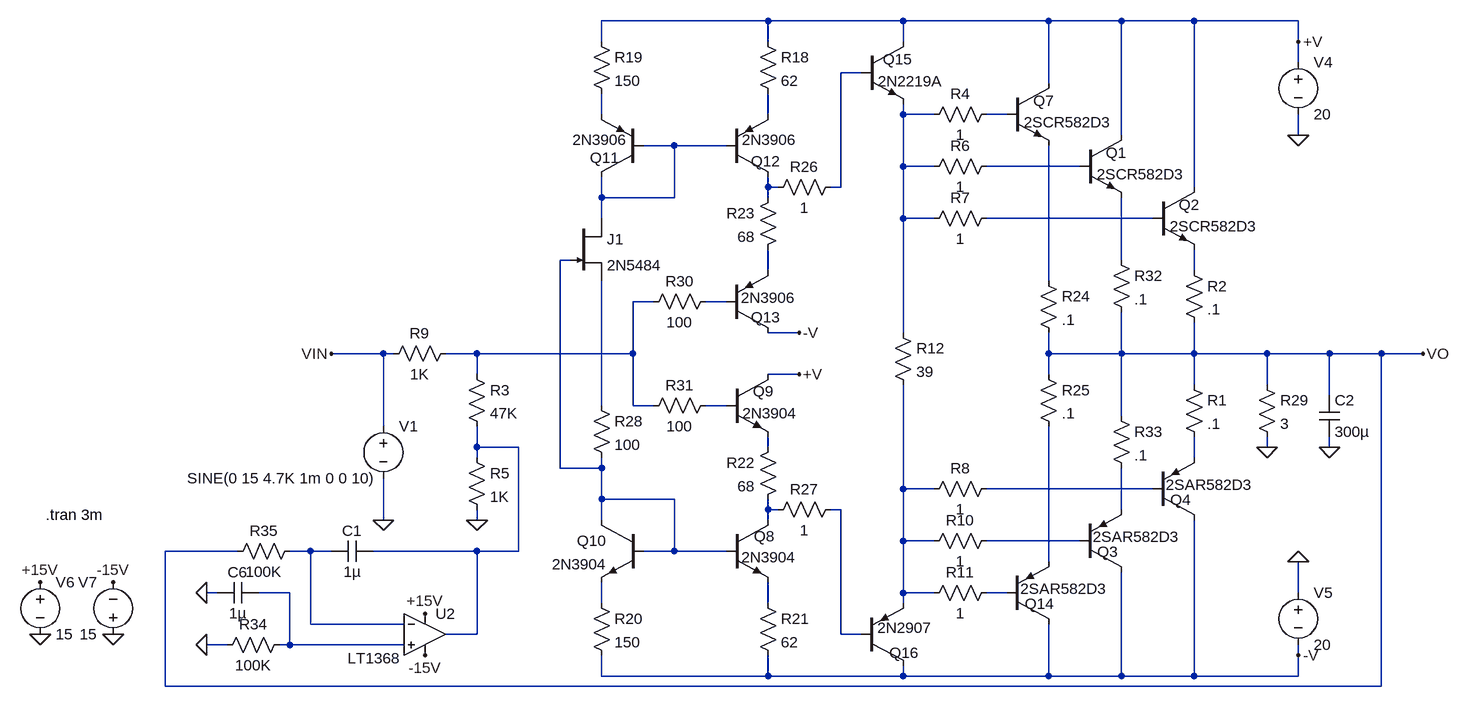
[diagram p0: schematic Current Amp-Adj_Bias-Servo-1.asc]
Current Amp-Adj_Bias-Servo-1.asc, the LTspice schematic file:
Version 4
SHEET 1 900 712
WIRE -160 -384 -416 -384
WIRE 48 -384 -160 -384
WIRE 272 -384 48 -384
WIRE 384 -384 272 -384
WIRE 496 -384 384 -384
WIRE 656 -384 496 -384
WIRE -416 -352 -416 -384
WIRE -160 -352 -160 -384
WIRE 48 -352 48 -384
WIRE 656 -352 656 -384
WIRE 656 -320 656 -352
WIRE -16 -304 -48 -304
WIRE 272 -288 272 -384
WIRE -416 -240 -416 -272
WIRE -160 -240 -160 -272
WIRE 48 -240 48 -256
WIRE 96 -240 48 -240
WIRE 208 -240 176 -240
WIRE 384 -208 384 -384
WIRE 656 -208 656 -240
WIRE -304 -192 -352 -192
WIRE -224 -192 -304 -192
WIRE 48 -160 48 -240
WIRE 96 -160 48 -160
WIRE 320 -160 176 -160
WIRE -160 -128 -160 -144
WIRE -144 -128 -160 -128
WIRE -48 -128 -48 -304
WIRE -48 -128 -64 -128
WIRE 496 -128 496 -384
WIRE -416 -112 -416 -144
WIRE -304 -112 -304 -192
WIRE -304 -112 -416 -112
WIRE -160 -112 -160 -128
WIRE -416 -80 -416 -112
WIRE 48 -80 48 -160
WIRE 96 -80 48 -80
WIRE 432 -80 176 -80
WIRE -464 -16 -480 -16
WIRE 384 -16 384 -112
WIRE -160 0 -160 -32
WIRE 496 0 496 -32
WIRE 272 16 272 -192
WIRE -336 48 -368 48
WIRE -224 48 -256 48
WIRE -112 96 -160 96
WIRE 48 96 48 -80
WIRE -752 128 -832 128
WIRE -736 128 -752 128
WIRE -608 128 -656 128
WIRE -368 128 -368 48
WIRE -368 128 -608 128
WIRE 272 128 272 96
WIRE 384 128 384 64
WIRE 384 128 272 128
WIRE 496 128 496 80
WIRE 496 128 384 128
WIRE 608 128 496 128
WIRE 704 128 608 128
WIRE 784 128 704 128
WIRE 848 128 784 128
WIRE -608 160 -608 128
WIRE -112 160 -160 160
WIRE 272 160 272 128
WIRE 496 176 496 128
WIRE 608 176 608 128
WIRE 704 192 704 128
WIRE -416 208 -416 16
WIRE -368 208 -368 128
WIRE -336 208 -368 208
WIRE -224 208 -256 208
WIRE 384 224 384 128
WIRE -752 240 -752 128
WIRE -608 272 -608 240
WIRE -544 272 -608 272
WIRE -160 272 -160 256
WIRE 608 272 608 256
WIRE 704 272 704 256
WIRE -608 288 -608 272
WIRE 496 288 496 256
WIRE -480 304 -480 -16
WIRE -416 304 -416 288
WIRE -416 304 -480 304
WIRE 48 336 48 176
WIRE 96 336 48 336
WIRE 432 336 176 336
WIRE -416 352 -416 304
WIRE -304 352 -416 352
WIRE -160 368 -160 352
WIRE -144 368 -160 368
WIRE -48 368 -64 368
WIRE 384 368 384 304
WIRE -752 384 -752 320
WIRE -608 384 -608 368
WIRE -416 384 -416 352
WIRE -160 384 -160 368
WIRE 48 416 48 336
WIRE 96 416 48 416
WIRE 320 416 176 416
WIRE -976 432 -1088 432
WIRE -864 432 -896 432
WIRE -832 432 -864 432
WIRE -608 432 -768 432
WIRE -544 432 -544 272
WIRE -544 432 -608 432
WIRE -304 432 -304 352
WIRE -304 432 -352 432
WIRE -224 432 -304 432
WIRE 272 448 272 240
WIRE -1008 496 -1024 496
WIRE -896 496 -944 496
WIRE 48 496 48 416
WIRE 96 496 48 496
WIRE 208 496 176 496
WIRE 656 496 656 448
WIRE -416 512 -416 480
WIRE -160 512 -160 480
WIRE 48 512 48 496
WIRE -864 544 -864 432
WIRE -720 544 -864 544
WIRE -608 560 -608 432
WIRE -608 560 -656 560
WIRE -48 560 -48 368
WIRE -16 560 -48 560
WIRE -992 576 -1024 576
WIRE -896 576 -896 496
WIRE -896 576 -912 576
WIRE -720 576 -896 576
WIRE 656 592 656 576
WIRE -416 624 -416 592
WIRE -160 624 -160 592
WIRE -160 624 -416 624
WIRE 48 624 48 608
WIRE 48 624 -160 624
WIRE 272 624 272 544
WIRE 272 624 48 624
WIRE 384 624 384 464
WIRE 384 624 272 624
WIRE 496 624 496 384
WIRE 496 624 384 624
WIRE 656 624 656 592
WIRE 656 624 496 624
WIRE -1088 640 -1088 432
WIRE 784 640 784 128
WIRE 784 640 -1088 640
FLAG 656 -208 0
FLAG 656 448 0
FLAG 608 272 0
FLAG 656 -352 +V
FLAG -112 160 +V
FLAG -112 96 -V
FLAG 656 592 -V
FLAG -1024 496 0
FLAG -1168 560 0
FLAG -1280 560 0
FLAG -688 528 +15V
FLAG -1280 480 +15V
FLAG -688 592 -15V
FLAG -1168 480 -15V
FLAG -608 384 0
FLAG -1024 576 0
FLAG -752 384 0
FLAG 704 272 0
FLAG -832 128 VIN
FLAG 848 128 VO
DATAFLAG -304 -192 ""
DATAFLAG -304 432 ""
DATAFLAG -800 576 ""
DATAFLAG -704 432 ""
DATAFLAG -560 128 ""
DATAFLAG 672 128 ""
DATAFLAG 48 0 ""
DATAFLAG 48 240 ""
DATAFLAG -48 -208 ""
DATAFLAG -48 464 ""
SYMBOL voltage 656 -336 R0
WINDOW 123 0 0 Left 2
WINDOW 39 0 0 Left 2
SYMATTR InstName V4
SYMATTR Value 20
SYMBOL voltage 656 480 R0
WINDOW 123 0 0 Left 2
WINDOW 39 0 0 Left 2
SYMATTR InstName V5
SYMATTR Value 20
SYMBOL npn 208 -288 R0
WINDOW 0 40 27 Left 2
WINDOW 3 26 60 Left 2
SYMATTR InstName Q7
SYMATTR Value 2SCR582D3
SYMBOL npn -224 384 R0
WINDOW 0 42 25 Left 2
WINDOW 3 23 57 Left 2
SYMATTR InstName Q8
SYMATTR Value 2N3904
SYMBOL npn -224 160 R0
WINDOW 0 41 26 Left 2
WINDOW 3 25 60 Left 2
SYMATTR InstName Q9
SYMATTR Value 2N3904
SYMBOL npn -352 384 M0
SYMATTR InstName Q10
SYMATTR Value 2N3904
SYMBOL pnp -352 -144 R180
WINDOW 0 36 29 Left 2
WINDOW 3 24 57 Left 2
SYMATTR InstName Q11
SYMATTR Value 2N3906
SYMBOL pnp -224 -144 M180
WINDOW 0 38 24 Left 2
WINDOW 3 24 57 Left 2
SYMATTR InstName Q12
SYMATTR Value 2N3906
SYMBOL pnp -224 96 M180
WINDOW 0 38 24 Left 2
WINDOW 3 22 54 Left 2
SYMATTR InstName Q13
SYMATTR Value 2N3906
SYMBOL pnp 208 544 M180
WINDOW 0 27 31 Left 2
WINDOW 3 20 54 Left 2
SYMATTR InstName Q14
SYMATTR Value 2SAR582D3
SYMBOL res -176 -368 R0
SYMATTR InstName R18
SYMATTR Value 62
SYMBOL res -432 -368 R0
SYMATTR InstName R19
SYMATTR Value 150
SYMBOL res -432 496 R0
SYMATTR InstName R20
SYMATTR Value 150
SYMBOL res -176 496 R0
SYMATTR InstName R21
SYMATTR Value 62
SYMBOL res -144 256 M0
SYMATTR InstName R22
SYMATTR Value 68
SYMBOL res -144 -128 M0
SYMATTR InstName R23
SYMATTR Value 68
SYMBOL res 256 0 R0
SYMATTR InstName R24
SYMATTR Value .1
SYMBOL res 256 144 R0
SYMATTR InstName R25
SYMATTR Value .1
SYMBOL res -48 -144 R90
WINDOW 0 0 56 VBottom 2
WINDOW 3 32 56 VTop 2
SYMATTR InstName R26
SYMATTR Value 1
SYMBOL res -48 352 R90
WINDOW 0 0 56 VBottom 2
WINDOW 3 32 56 VTop 2
SYMATTR InstName R27
SYMATTR Value 1
SYMBOL res -432 192 R0
SYMATTR InstName R28
SYMATTR Value 100
SYMBOL njf -464 -80 R0
SYMATTR InstName J1
SYMATTR Value 2N5484
SYMBOL res 592 160 R0
SYMATTR InstName R29
SYMATTR Value 3
SYMBOL res -352 64 R270
WINDOW 0 32 56 VTop 2
WINDOW 3 0 56 VBottom 2
SYMATTR InstName R30
SYMATTR Value 100
SYMBOL res -352 224 R270
WINDOW 0 32 56 VTop 2
WINDOW 3 0 56 VBottom 2
SYMATTR InstName R31
SYMATTR Value 100
SYMBOL npn -16 -352 R0
WINDOW 0 33 27 Left 2
WINDOW 3 25 61 Left 2
SYMATTR InstName Q15
SYMATTR Value 2N2219A
SYMBOL pnp -16 608 M180
WINDOW 0 43 20 Left 2
WINDOW 3 24 58 Left 2
SYMATTR InstName Q16
SYMATTR Value 2N2907
SYMBOL res 368 -32 R0
SYMATTR InstName R32
SYMATTR Value .1
SYMBOL res 368 208 R0
SYMATTR InstName R33
SYMATTR Value .1
SYMBOL res -896 560 R90
WINDOW 0 0 56 VBottom 2
WINDOW 3 32 56 VTop 2
SYMATTR InstName R34
SYMATTR Value 100K
SYMBOL cap -768 416 R90
WINDOW 0 0 32 VBottom 2
WINDOW 3 32 32 VTop 2
SYMATTR InstName C1
SYMATTR Value 1µ
SYMBOL cap -944 480 R90
WINDOW 0 0 32 VBottom 2
WINDOW 3 32 32 VTop 2
SYMATTR InstName C6
SYMATTR Value 1µ
SYMBOL Opamps\\LT1368 -688 496 R0
WINDOW 3 -119 101 Left 2
SYMATTR InstName U2
SYMBOL voltage -1280 464 R0
WINDOW 123 0 0 Left 2
WINDOW 39 0 0 Left 2
SYMATTR InstName V6
SYMATTR Value 15
SYMBOL voltage -1168 576 R180
WINDOW 0 24 96 Left 2
WINDOW 3 24 16 Left 2
WINDOW 123 0 0 Left 2
WINDOW 39 0 0 Left 2
SYMATTR InstName V7
SYMATTR Value 15
SYMBOL res -880 416 R90
WINDOW 0 0 56 VBottom 2
WINDOW 3 32 56 VTop 2
SYMATTR InstName R35
SYMATTR Value 100K
SYMBOL res -624 144 R0
SYMATTR InstName R3
SYMATTR Value 47K
SYMBOL res -624 272 R0
SYMATTR InstName R5
SYMATTR Value 1K
SYMBOL npn 320 -208 R0
WINDOW 0 40 27 Left 2
WINDOW 3 26 60 Left 2
SYMATTR InstName Q1
SYMATTR Value 2SCR582D3
SYMBOL npn 432 -128 R0
WINDOW 0 40 27 Left 2
WINDOW 3 26 60 Left 2
SYMATTR InstName Q2
SYMATTR Value 2SCR582D3
SYMBOL pnp 320 464 M180
WINDOW 0 27 31 Left 2
WINDOW 3 20 54 Left 2
SYMATTR InstName Q3
SYMATTR Value 2SAR582D3
SYMBOL pnp 432 384 M180
WINDOW 0 27 31 Left 2
WINDOW 3 20 54 Left 2
SYMATTR InstName Q4
SYMATTR Value 2SAR582D3
SYMBOL res 480 160 R0
SYMATTR InstName R1
SYMATTR Value .1
SYMBOL res 480 -16 R0
SYMATTR InstName R2
SYMATTR Value .1
SYMBOL res 192 -256 R90
WINDOW 0 0 56 VBottom 2
WINDOW 3 32 56 VTop 2
SYMATTR InstName R4
SYMATTR Value 1
SYMBOL res 192 -176 R90
WINDOW 0 0 56 VBottom 2
WINDOW 3 32 56 VTop 2
SYMATTR InstName R6
SYMATTR Value 1
SYMBOL res 192 -96 R90
WINDOW 0 0 56 VBottom 2
WINDOW 3 32 56 VTop 2
SYMATTR InstName R7
SYMATTR Value 1
SYMBOL res 192 320 R90
WINDOW 0 0 56 VBottom 2
WINDOW 3 32 56 VTop 2
SYMATTR InstName R8
SYMATTR Value 1
SYMBOL res 192 400 R90
WINDOW 0 0 56 VBottom 2
WINDOW 3 32 56 VTop 2
SYMATTR InstName R10
SYMATTR Value 1
SYMBOL res 192 480 R90
WINDOW 0 0 56 VBottom 2
WINDOW 3 32 56 VTop 2
SYMATTR InstName R11
SYMATTR Value 1
SYMBOL res 32 80 R0
SYMATTR InstName R12
SYMATTR Value 39
SYMBOL voltage -752 224 R0
WINDOW 3 -302 96 Left 2
WINDOW 123 0 0 Left 0
WINDOW 39 0 0 Left 0
SYMATTR Value SINE(0 15 4.7K 1m 0 0 10)
SYMATTR InstName V1
SYMBOL res -640 112 R90
WINDOW 0 0 56 VBottom 2
WINDOW 3 32 56 VTop 2
SYMATTR InstName R9
SYMATTR Value 1K
SYMBOL cap 688 192 R0
SYMATTR InstName C2
SYMATTR Value 300µ
TEXT -1272 376 Left 2 !.tran 3m

The netlist it stands for:
* Current Amp-Adj_Bias-Servo-1.asc
V4 +V 0 20
V5 0 -V 20
Q7 +V N005 N014 0 2SCR582D3
Q8 N024 N010 N033 0 2N3904
Q9 +V N018 N020 0 2N3904
Q10 N010 N010 N032 0 2N3904
Q11 N006 N006 N002 0 2N3906
Q12 N008 N006 N003 0 2N3906
Q13 -V N016 N012 0 2N3906
Q14 -V N031 N029 0 2SAR582D3
R18 +V N003 62
R19 +V N002 150
R20 N032 -V 150
R21 N033 -V 62
R22 N020 N024 68
R23 N008 N012 68
R24 N014 VO .1
R25 VO N029 .1
R26 N001 N008 1
R27 N025 N024 1
R28 N017 N010 100
J1 N006 N010 N017 2N5484
R29 VO 0 3
R30 N015 N016 100
R31 N015 N018 100
Q15 +V N001 N004 0 2N2219A
Q16 -V N025 N022 0 2N2907
R32 N011 VO .1
R33 VO N026 .1
R34 N030 0 100K
C1 N019 N028 1µ
C6 N030 0 1µ
XU2 N030 N028 +15V -15V N019 LT1368  ; pins In+ In- V+ V- OUT
V6 +15V 0 15
V7 0 -15V 15
R35 N028 VO 100K
R3 N015 N019 47K
R5 N019 0 1K
Q1 +V N007 N011 0 2SCR582D3
Q2 +V N009 N013 0 2SCR582D3
Q3 -V N027 N026 0 2SAR582D3
Q4 -V N023 N021 0 2SAR582D3
R1 VO N021 .1
R2 N013 VO .1
R4 N005 N004 1
R6 N007 N004 1
R7 N009 N004 1
R8 N023 N022 1
R10 N027 N022 1
R11 N031 N022 1
R12 N004 N022 39
V1 VIN 0 SINE(0 15 4.7K 1m 0 0 10)
R9 N015 VIN 1K
C2 VO 0 300µ
.model NPN NPN
.model PNP PNP
.lib standard.bjt
.model NJF NJF
.model PJF PJF
.lib standard.jft
.tran 3m
.backanno
.end